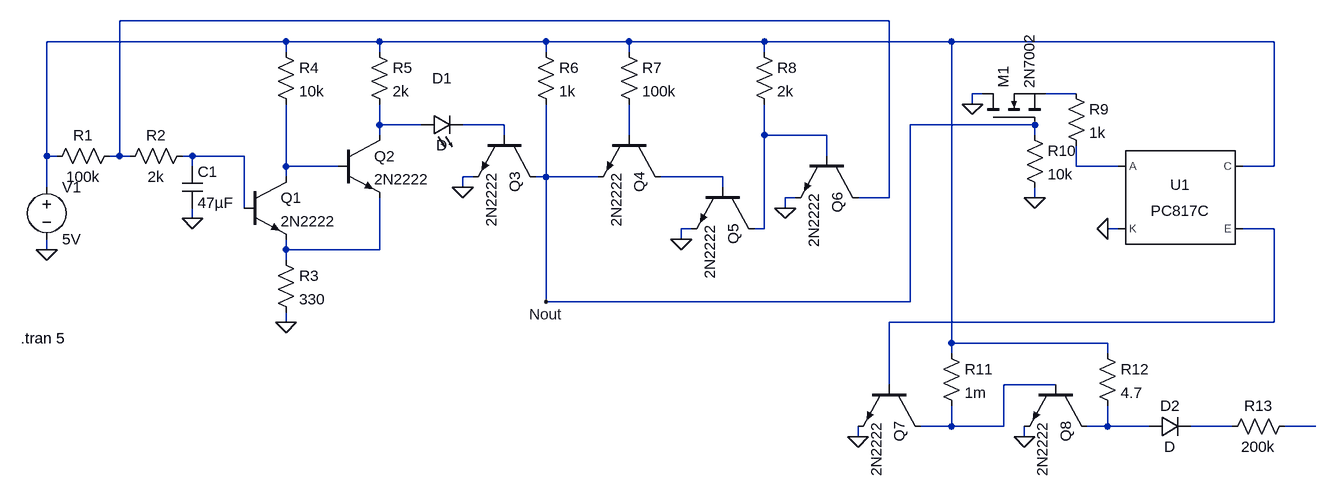
[diagram p0: schematic NeuronSynapseVersion2.asc]
NeuronSynapseVersion2.asc, the LTspice schematic file:
Version 4.1
SHEET 1 2404 680
WIRE 1440 -128 256 -128
WIRE 512 -96 144 -96
WIRE 656 -96 512 -96
WIRE 912 -96 656 -96
WIRE 1040 -96 912 -96
WIRE 1248 -96 1040 -96
WIRE 1536 -96 1248 -96
WIRE 2032 -96 1536 -96
WIRE 512 -80 512 -96
WIRE 656 -80 656 -96
WIRE 912 -80 912 -96
WIRE 1040 -80 1040 -96
WIRE 1248 -80 1248 -96
WIRE 1584 -16 1568 -16
WIRE 1728 -16 1680 -16
WIRE 1568 0 1568 -16
WIRE 656 32 656 0
WIRE 720 32 656 32
WIRE 848 32 784 32
WIRE 1664 32 1472 32
WIRE 656 48 656 32
WIRE 848 48 848 32
WIRE 1040 48 1040 0
WIRE 1248 48 1248 0
WIRE 1344 48 1248 48
WIRE 1664 48 1664 32
WIRE 144 80 144 -96
WIRE 160 80 144 80
WIRE 256 80 256 -128
WIRE 256 80 240 80
WIRE 272 80 256 80
WIRE 368 80 352 80
WIRE 448 80 368 80
WIRE 1344 80 1344 48
WIRE 368 96 368 80
WIRE 512 96 512 0
WIRE 592 96 512 96
WIRE 1728 96 1728 64
WIRE 1792 96 1728 96
WIRE 2032 96 2032 -96
WIRE 2032 96 1984 96
WIRE 512 112 512 96
WIRE 800 112 784 112
WIRE 912 112 912 0
WIRE 912 112 896 112
WIRE 992 112 912 112
WIRE 1184 112 1088 112
WIRE 144 128 144 80
WIRE 784 128 784 112
WIRE 1184 128 1184 112
WIRE 1296 144 1280 144
WIRE 1440 144 1440 -128
WIRE 1440 144 1392 144
WIRE 1664 144 1664 128
WIRE 448 160 448 80
WIRE 1280 160 1280 144
WIRE 368 176 368 160
WIRE 1136 192 1120 192
WIRE 1248 192 1248 48
WIRE 1248 192 1232 192
WIRE 1792 192 1776 192
WIRE 2032 192 1984 192
WIRE 1120 208 1120 192
WIRE 144 224 144 208
WIRE 512 224 512 208
WIRE 656 224 656 144
WIRE 656 224 512 224
WIRE 512 240 512 224
WIRE 912 304 912 112
WIRE 1472 304 1472 32
WIRE 1472 304 912 304
WIRE 512 336 512 320
WIRE 2032 336 2032 192
WIRE 2032 336 1440 336
WIRE 1536 368 1536 -96
WIRE 1776 368 1536 368
WIRE 1536 384 1536 368
WIRE 1776 384 1776 368
WIRE 1440 432 1440 336
WIRE 1696 432 1616 432
WIRE 1536 496 1536 464
WIRE 1536 496 1488 496
WIRE 1616 496 1616 432
WIRE 1616 496 1536 496
WIRE 1776 496 1776 464
WIRE 1776 496 1744 496
WIRE 1840 496 1776 496
WIRE 1968 496 1904 496
WIRE 2096 496 2048 496
WIRE 1392 512 1392 496
WIRE 1648 512 1648 496
FLAG 144 224 0
FLAG 368 176 0
FLAG 512 336 0
FLAG 784 128 0
FLAG 1120 208 0
FLAG 1280 160 0
FLAG 912 304 Nout
FLAG 1568 0 0
FLAG 1664 144 0
FLAG 1392 512 0
FLAG 1648 512 0
FLAG 1776 192 0
SYMBOL voltage 144 112 R0
WINDOW 123 0 0 Left 0
WINDOW 39 0 0 Left 0
SYMATTR InstName V1
SYMATTR Value 5V
SYMBOL res 256 64 R90
WINDOW 0 0 56 VBottom 2
WINDOW 3 32 56 VTop 2
SYMATTR InstName R1
SYMATTR Value 100k
SYMBOL res 368 64 R90
WINDOW 0 0 56 VBottom 2
WINDOW 3 32 56 VTop 2
SYMATTR InstName R2
SYMATTR Value 2k
SYMBOL cap 352 96 R0
SYMATTR InstName C1
SYMATTR Value 47µF
SYMBOL npn 448 112 R0
SYMATTR InstName Q1
SYMATTR Value 2N2222
SYMBOL res 496 224 R0
SYMATTR InstName R3
SYMATTR Value 330
SYMBOL npn 592 48 R0
SYMATTR InstName Q2
SYMATTR Value 2N2222
SYMBOL res 640 -96 R0
SYMATTR InstName R5
SYMATTR Value 2k
SYMBOL res 496 -96 R0
SYMATTR InstName R4
SYMATTR Value 10k
SYMBOL LED 720 48 R270
WINDOW 0 72 32 VTop 2
WINDOW 3 0 32 VBottom 2
SYMATTR InstName D1
SYMBOL npn 896 48 R90
SYMATTR InstName Q3
SYMATTR Value 2N2222
SYMBOL res 896 -96 R0
SYMATTR InstName R6
SYMATTR Value 1k
SYMBOL npn 1088 48 R90
SYMATTR InstName Q4
SYMATTR Value 2N2222
SYMBOL res 1024 -96 R0
SYMATTR InstName R7
SYMATTR Value 100k
SYMBOL npn 1232 128 R90
SYMATTR InstName Q5
SYMATTR Value 2N2222
SYMBOL res 1232 -96 R0
SYMATTR InstName R8
SYMATTR Value 2k
SYMBOL npn 1392 80 R90
SYMATTR InstName Q6
SYMATTR Value 2N2222
SYMBOL nmos 1584 32 R270
SYMATTR InstName M1
SYMATTR Value 2N7002
SYMBOL res 1712 -32 R0
SYMATTR InstName R9
SYMATTR Value 1k
SYMBOL res 1648 32 R0
SYMATTR InstName R10
SYMATTR Value 10k
SYMBOL res 1520 368 R0
SYMATTR InstName R11
SYMATTR Value 1m
SYMBOL npn 1488 432 R90
SYMATTR InstName Q7
SYMATTR Value 2N2222
SYMBOL npn 1744 432 R90
SYMATTR InstName Q8
SYMATTR Value 2N2222
SYMBOL res 1760 368 R0
SYMATTR InstName R12
SYMATTR Value 4.7
SYMBOL diode 1840 512 R270
WINDOW 0 32 32 VTop 2
WINDOW 3 0 32 VBottom 2
SYMATTR InstName D2
SYMBOL res 2064 480 R90
WINDOW 0 0 56 VBottom 2
WINDOW 3 32 56 VTop 2
SYMATTR InstName R13
SYMATTR Value 200k
SYMBOL Optos\\PC817C 1888 144 R0
SYMATTR InstName U1
TEXT 104 360 Left 2 !.tran 5

The netlist it stands for:
* NeuronSynapseVersion2.asc
V1 N002 0 5V
R1 N001 N002 100k
R2 N008 N001 2k
C1 N008 0 47µF
Q1 N009 N008 N013 0 2N2222
R3 N013 0 330
Q2 N004 N009 N013 0 2N2222
R5 N002 N004 2k
R4 N002 N009 10k
D1 N004 N005 D
Q3 Nout N005 0 0 2N2222
R6 N002 Nout 1k
Q4 N011 N006 Nout 0 2N2222
R7 N002 N006 100k
Q5 N007 N011 0 0 2N2222
R8 N002 N007 2k
Q6 N001 N007 0 0 2N2222
M1 0 Nout N003 N003 2N7002
R9 N003 N010 1k
R10 Nout 0 10k
R11 N002 N014 1m
Q7 N014 N012 0 0 2N2222
Q8 N015 N014 0 0 2N2222
R12 N002 N015 4.7
D2 N015 N016 D
R13 N017 N016 200k
X§U1 N010 0 N002 N012 PC817 Igain=2.3m  ; PC817C, pins A K C E
.model D D
.lib standard.dio
.model NPN NPN
.model PNP PNP
.lib standard.bjt
.model NMOS NMOS
.model PMOS PMOS
.lib standard.mos
.tran 5
.lib PC817.sub
.backanno
.end